# Altium schematic sheet Schematic_Sheet.SchDoc
size A3; SheetNumber: 1; SheetTotal: 1
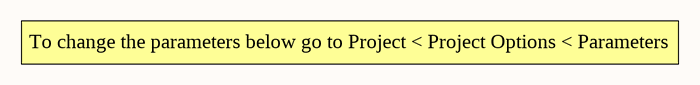
[diagram p0: Schematic_Sheet.SchDoc]

## Notes on the sheet
- To change the parameters below go to Project < Project Options < Parameters
- Title:
- Design Name:
- Project:
- Revision:
- Designer:
- Date:
- Time:
- File:
- Document Size:
- A3